# EAGLE design Floppy_V2.5.1_production (EAGLE 7.5.0)
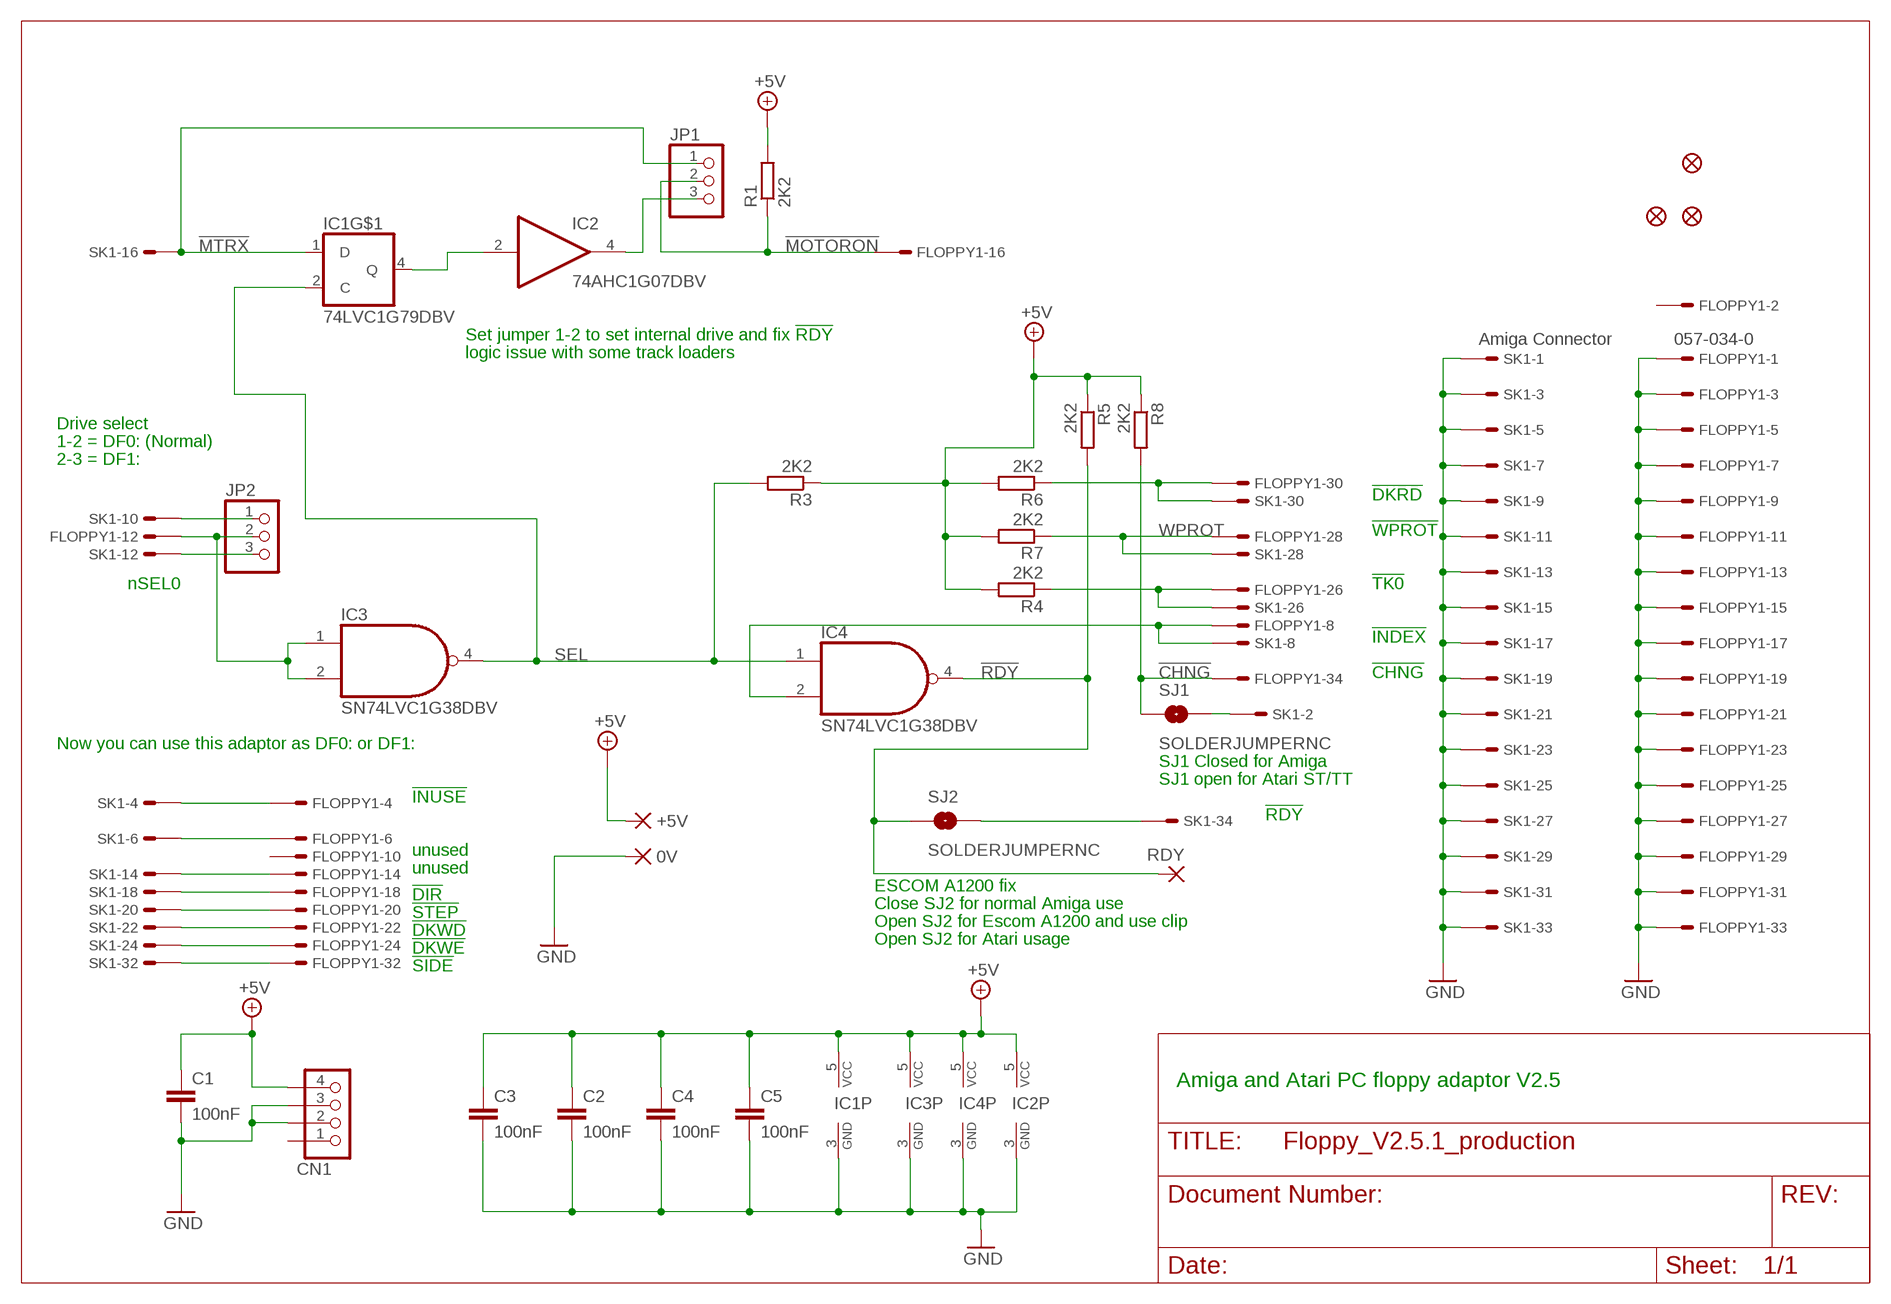
[diagram p0: schematic, sheet 1]

## Parts
0V  PAD-0360-S  [0360-S]
+5V  PAD-0360-S  [0360-S]
C1  100nF  C-EUC0603  [C0603]
C2  100nF  C-EUC0603  [C0603]
C3  100nF  C-EUC0603  [C0603]
C4  100nF  C-EUC0603  [C0603]
C5  100nF  C-EUC0603  [C0603]
CN1  IANS_FLOPPY_RA  [IANS_FLOPPYPOWER__RA]
FLOPPY1  057-034-0  [057-034-0]
IC1  74LVC1G79DBV  [SOT23-5]
IC2  74AHC1G07DBV  [SOT23-5]
IC3  SN74LVC1G38DBV  74AHC1G00DBV  [SOT23-5]
IC4  SN74LVC1G38DBV  74AHC1G00DBV  [SOT23-5]
JP1  PINHD-1X3  [1X03]
JP2  PINHD-1X3  [1X03]
JP3  FIDUCIAL1X2  [FIDUCIAL-1X2]
JP4  FIDUCIAL1X2  [FIDUCIAL-1X2]
JP5  FIDUCIAL1X2  [FIDUCIAL-1X2]
R1  2K2  R-EU_R0603  [R0603]
R3  2K2  R-EU_R0603  [R0603]
R4  2K2  R-EU_R0603  [R0603]
R5  2K2  R-EU_R0603  [R0603]
R6  2K2  R-EU_R0603  [R0603]
R7  2K2  R-EU_R0603  [R0603]
R8  2K2  R-EU_R0603  [R0603]
RDY  2,15/1,0  [2,15/1,0]
SJ1  SOLDERJUMPERNC  [SJ_2S]
SJ2  SOLDERJUMPERNC  [SJ_2S]
SK1  Amiga Connector  057-034-1  [057-034-1]

## Nets
!CHNG: FLOPPY1.34 R8.2 SJ1.1
!MOTORON: FLOPPY1.16 JP1.2 R1.1
!MTRX: IC1.1(D) JP1.1 SK1.16
!RDY: IC4.4(O) R5.2 RDY.1(P) SJ2.1
+5V: +5V.P$1(P) C1.1 C2.1 C3.1 C4.1 C5.1 CN1.4(+5V) IC1.5(VCC) IC2.5(VCC) IC3.5(VCC) IC4.5(VCC) R1.2 R3.1 R4.2 R5.1 R6.2 R7.2 R8.1
GND: 0V.P$1(P) C1.2 C2.2 C3.2 C4.2 C5.2 CN1.2(GND) CN1.3(GND) FLOPPY1.1 FLOPPY1.3 FLOPPY1.5 FLOPPY1.7 FLOPPY1.9 FLOPPY1.11 FLOPPY1.13 FLOPPY1.15 FLOPPY1.17 FLOPPY1.19 FLOPPY1.21 FLOPPY1.23 FLOPPY1.25 FLOPPY1.27 FLOPPY1.29 FLOPPY1.31 FLOPPY1.33 IC1.3(GND) IC2.3(GND) IC3.3(GND) IC4.3(GND) SK1.1 SK1.3 SK1.5 SK1.7 SK1.9 SK1.11 SK1.13 SK1.15 SK1.17 SK1.19 SK1.21 SK1.23 SK1.25 SK1.27 SK1.29 SK1.31 SK1.33
N$1: IC1.4(Q) IC2.2(I)
N$2: IC2.4(O) JP1.3
N$4: FLOPPY1.8 IC4.2(I1) SK1.8
N$5: FLOPPY1.26 R4.1 SK1.26
N$6: FLOPPY1.14 SK1.14
N$8: FLOPPY1.30 R6.1 SK1.30
N$9: JP2.1 SK1.10
N$10: FLOPPY1.12 IC3.1(I0) IC3.2(I1) JP2.2
N$11: JP2.3 SK1.12
N$12: FLOPPY1.18 SK1.18
N$13: FLOPPY1.20 SK1.20
N$14: FLOPPY1.22 SK1.22
N$15: FLOPPY1.24 SK1.24
N$16: FLOPPY1.32 SK1.32
N$17: FLOPPY1.4 SK1.4
N$18: FLOPPY1.6 SK1.6
N$19: SJ1.2 SK1.2
N$20: SJ2.2 SK1.34
SEL: IC1.2(C) IC3.4(O) IC4.1(I0) R3.2
WPROT: FLOPPY1.28 R7.1 SK1.28
Unconnected: CN1.1(+12V) FLOPPY1.2 FLOPPY1.10

## Notes on the sheet
- Set jumper 1-2 to set internal drive and fix !RDY
- logic issue with some track loaders
- Drive select
- 1-2 = DF0: (Normal)
- 2-3 = DF1:
- !DKRD
- !WPROT
- nSEL0 | !TK0
- !INDEX
- !CHNG
- Now you can use this adaptor as DF0: or DF1:
- SJ1 Closed for Amiga
- SJ1 open for Atari ST/TT
- !INUSE
- !RDY
- unused
- unused
- ESCOM A1200 fix
- !DIR
- Close SJ2 for normal Amiga use
- !STEP
- Open SJ2 for Escom A1200 and use clip
- !DKWD
- Open SJ2 for Atari usage
- !DKWE
- !SIDE
- Amiga and Atari PC floppy adaptor V2.5

## Library data of the parts
0V +5V = dpads:PAD: WIRE PAD Standard US Drill Sizes and SMD pads
C1-C5 = resistor:C-EU: CAPACITOR, European symbol
CN1 = Floppy-connectors:IANS_FLOPPY_RA
FLOPPY1 = Floppy-connectors:057-034-: CONNECTOR 34-pin series 057 contact pc boardFloppy drive headers Rapid part numbers Normal right Angle 50-8132; OC_FARNELL: unknown; OC_NEWARK: unknown
IC1 = 74xx-little-us:74*1G79: Single Positive-Edge-Triggered D-Type Flip-Flop Source: Data sheet <http://www.ti.com/lit/ds/symlink/sn74lvc1g79.pdf>
IC2 = 74xx-little-us:74*1G07: Single Buffer/Driver With Open-Drain Output
IC3 IC4 = 74xx-little-us:74*1G00: 2-input NAND gate
JP1 JP2 = pinhead:PINHD-1X3: PIN HEADER
JP3-JP5 = SparkFun:FIDUCIAL: Fiducial Alignment Points Various fiducial points for machine vision alignment.
R1 R3-R8 = resistor:R-EU_: RESISTOR, European symbol
RDY = wirepad:2,15/1,0: THROUGH-HOLE PAD
SJ1 SJ2 = SparkFun:SOLDERJUMPER: Solder Jumper Standard SMD solder jumper. Used to automate production. Two varients : Normally Open and Normally Closed are the same, but have different paste layers. NC will have a large amount of paste and should jumper during reflow.
SK1 = con-panduit:057-034-: CONNECTOR 34-pin series 057 contact pc board low profile headers; OC_FARNELL: unknown; OC_NEWARK: unknown

## Board
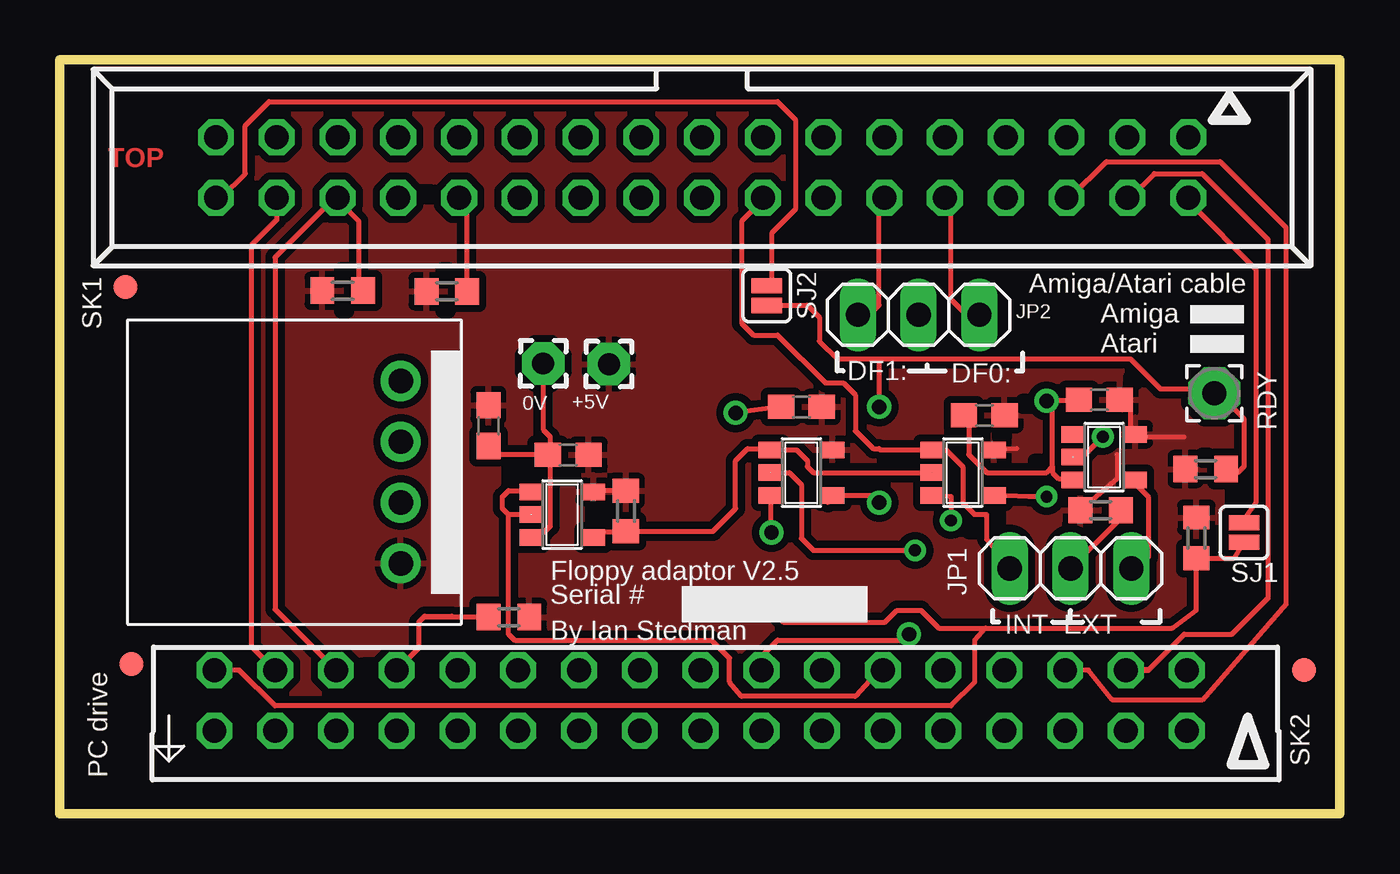
[diagram p1: board, top side]
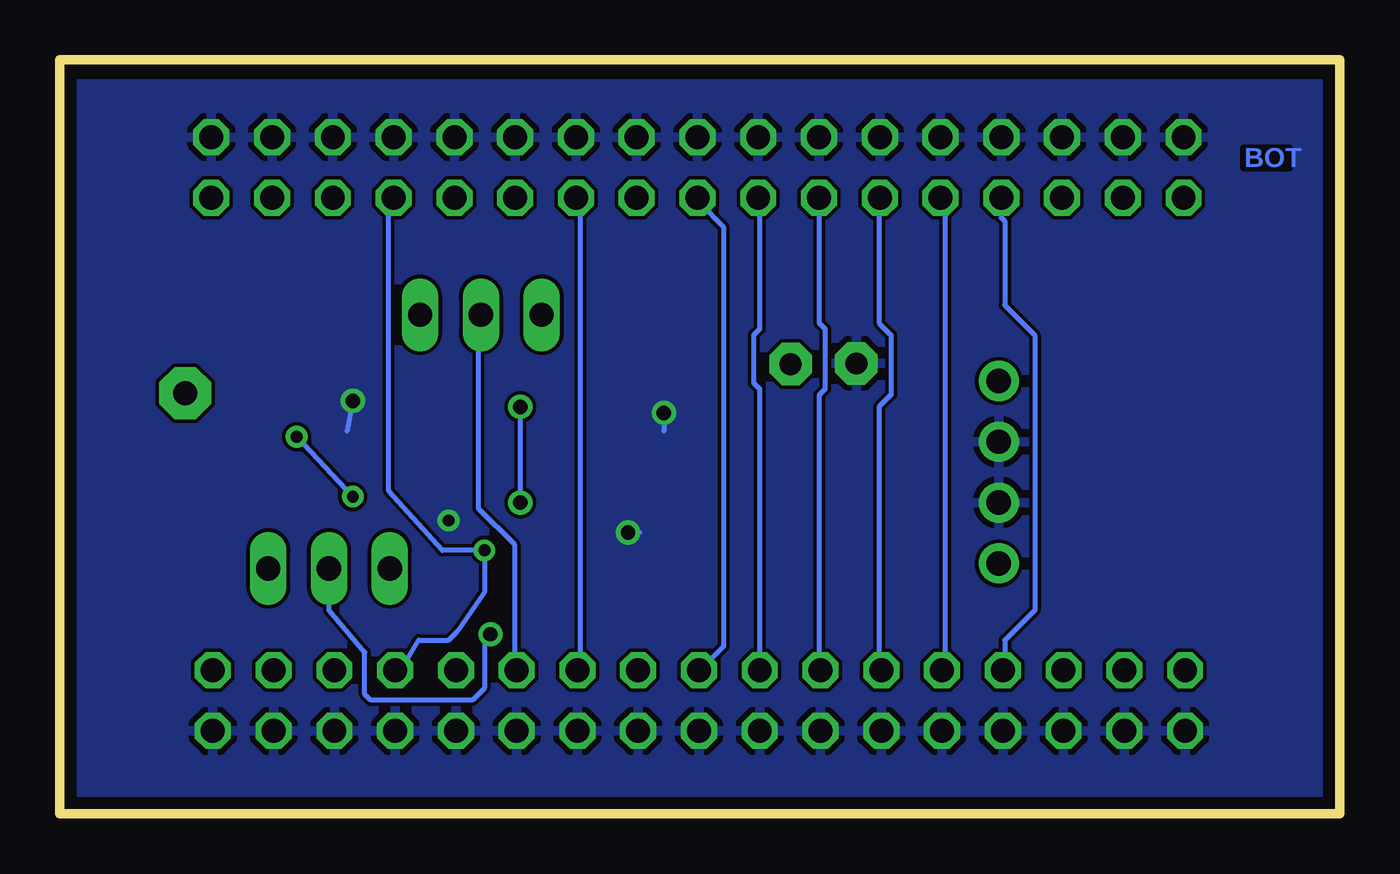
[diagram p2: board, bottom side, seen from below]

Size 53.5 x 31.5 mm. Coordinates in mm from the lower left corner, seen from the top.
Outline: 0,31.5 0,0 53.5,0 53.5,31.5 0,31.5
Copper layers (1*16): Top 0.035mm / dielectric 1.5mm / Bottom 0.035mm
Design rules "Ragworm": minimum track width 0.15mm, minimum drill 0.5mm, track to track 6mil, track to pad 6mil, pad to pad 6mil, via to via 6mil, smd to smd 6mil, copper to edge 0.5mm, drill to drill 0.5mm, minimum pad ring 5mil, minimum via ring 8mil, stop-mask expansion 0mil, vias tented up to drill 0mil, thermal gap 10mil
tRestrict: area 12.8,6 to 13,6.2; area 15.2,25.8 to 15.5,26; area 39.2,15.8 to 39.5,16; area 40.2,17 to 40.5,17.2; area 40.8,14.5 to 41,14.8; area 39,12 to 39.2,12.5; area 38,11.8 to 38.2,12; area 49,13 to 49.2,13.5; area 48.2,11.5 to 48.5,11.8; area 47.8,14.8 to 48,15; area 44.8,18 to 45,18.2; area 18.8,14 to 19,14.5; 8 more areas

### Footprints (pad centres in the part's own frame; a part is rotated, then mirrored left to right if it is on the bottom)
0360-S = drill 0.914 pad 1.778 octagon: P$1 0,0
C0603 = smd 1.1 x 1: 1 -0.85,0; 2 0.85,0
IANS_FLOPPYPOWER__RA = drill 1.016 pad 1.676: 1 0,5.08; 2 0,2.54; 3 0,0; 4 0,-2.54
057-034-0 = drill 1 octagon: 1 -20.32,-2.54; 2 -20.32,-5.08; 3 -17.78,-2.54; 4 -17.78,-5.08; 5 -15.24,-2.54; 6 -15.24,-5.08; 7 -12.7,-2.54; 8 -12.7,-5.08; 9 -10.16,-2.54; 10 -10.16,-5.08; 11 -7.62,-2.54; 12 -7.62,-5.08; 13 -5.08,-2.54; 14 -5.08,-5.08; 15 -2.54,-2.54; 16 -2.54,-5.08; 17 0,-2.54; 18 0,-5.08; 19 2.54,-2.54; 20 2.54,-5.08; 21 5.08,-2.54; 22 5.08,-5.08; 23 7.62,-2.54; 24 7.62,-5.08; 25 10.16,-2.54; 26 10.16,-5.08; 27 12.7,-2.54; 28 12.7,-5.08; 29 15.24,-2.54; 30 15.24,-5.08; 31 17.78,-2.54; 32 17.78,-5.08; 33 20.32,-2.54; 34 20.32,-5.08
SOT23-5 = smd 0.69 x 0.99: 1 -0.95,-1.29; 2 0,-1.29; 3 0.95,-1.29; 4 0.95,1.3; 5 -0.95,1.3
1X03 = drill 1.016 long: 1 -2.54,0; 2 0,0; 3 2.54,0
FIDUCIAL-1X2 = smd 1 x 1: 1 0,0
R0603 = smd 1 x 1.1: 1 -0.85,0; 2 0.85,0
2,15/1,0 = drill 1.016 pad 2.159 octagon: 1 0,0
SJ_2S = smd 0.635 x 1.27: 1 -0.412,0; 2 0.412,0
057-034-1 = drill 1 octagon: 1 -20.32,-1.27; 2 -20.32,1.27; 3 -17.78,-1.27; 4 -17.78,1.27; 5 -15.24,-1.27; 6 -15.24,1.27; 7 -12.7,-1.27; 8 -12.7,1.27; 9 -10.16,-1.27; 10 -10.16,1.27; 11 -7.62,-1.27; 12 -7.62,1.27; 13 -5.08,-1.27; 14 -5.08,1.27; 15 -2.54,-1.27; 16 -2.54,1.27; 17 0,-1.27; 18 0,1.27; 19 2.54,-1.27; 20 2.54,1.27; 21 5.08,-1.27; 22 5.08,1.27; 23 7.62,-1.27; 24 7.62,1.27; 25 10.16,-1.27; 26 10.16,1.27; 27 12.7,-1.27; 28 12.7,1.27; 29 15.24,-1.27; 30 15.24,1.27; 31 17.78,-1.27; 32 17.78,1.27; 33 20.32,-1.27; 34 20.32,1.27

### Placement (x,y rotation side)
0V  20.2,18.81 270 top
+5V  22.95,18.79 270 top
C1  17.92,16.21 270 top
C2  21.25,15 180 top
C3  31,17 180 top
C4  38.64,16.65 180 top
C5  43.45,17.3 180 top
CN1  14.25,13 0 top
FLOPPY1  26.78,0.92 180 top
IC1  37.75,14.25 270 top
IC2  43.65,14.9 270 top
IC3  21,12.5 270 top
IC4  31,14.25 270 top
JP1  42.25,10.25 0 top
JP2  35.9,20.84 180 top
JP3  3,6.25 0 top
JP4  52,6 0 top
JP5  2.75,22 0 top
R1  43.5,12.68 180 top
R3  23.66,12.64 270 top
R4  16.18,21.82 180 top
R5  47.9,14.4 0 top
R6  11.82,21.86 180 top
R7  18.77,8.21 0 top
R8  47.51,11.53 270 top
RDY  48.26,17.57 0 top
SJ1  49.5,11.75 90 top
SJ2  29.55,21.65 90 top
SK1  26.85,27 180 top

### Tracks (layer width: path | path; a pad name or v marks a point on that pad's centre or on a via)
!CHNG
  Top 0.2: FLOPPY1.34 7.5,6 9,4.5 37.25,4.5 38.25,5.5 38.25,7.25 38.7,7.75 | 29.5,8.75 30.25,8 34.5,8 35,8.5 36,8.5 36.75,7.75 38.7,7.75 | 38.7,7.75 46.5,7.75 47.5,8.5 R8.2 49.09,10.68 SJ1.1
!MOTORON  (via drill 0.6)
  Top 0.2: R1.1 44.25,12.5 44.25,12.25 JP1.2 | FLOPPY1.16 29.32,6.57 30,7.25 35.25,7.25 v35.5,7.5
  Bottom 0.2: v35.5,7.5 35.75,7.25 35.75,5.25 36.25,4.75 40.5,4.75 40.75,5 40.75,6.75 42.25,8.5 JP1.2
!MTRX
  Top 0.2: SK1.16 29.25,25.5 28.5,24.75 28.5,20.5 29,20 30,20 32,18 32.75,18 33.25,17.5 33.25,16 34,15.25 34.25,15.25 34.3,15.2 IC1.1 37.05,15.2 37.75,14.5 37.75,13 38.25,12.5 38.75,12.5 38.75,11.46 JP1.1
!RDY  (via drill 0.6)
  Top 0.15: 48.5,17.5 RDY.1 48.25,17.75 | 29.75,21 SJ2.1
  Top 0.2: 48.5,17.5 49.5,16.5 49.5,14.5 49.25,14.25 48.9,14.25 R5.2 | 48.25,17.75 46,17.75 44.75,19 34.25,19 | 32.1,13 IC4.4 33.95,13.3 v34.25,13 | 34.25,19 32.5,19 31.75,19.75 31.75,20.75 31.25,21.25 30,21.25 29.75,21 | 34.25,19 v34.25,17
  Bottom 0.2: v34.25,13 v34.25,17
+5V
  Top 0.15: 39.5,16.5 C4.1 | 15.5,21.75 R4.2
  Top 0.2: 40,15.25 IC1.5 | IC2.5 44.75,16 44.75,17 44.5,17.25 C5.1 | 44.2,15 44.2,14 42.75,12.75 R1.2 42.5,12.5 | 44.75,15.75 IC2.5 | 47,15.75 45,15.75 IC2.5 | 11,21.75 R6.2 | 17.75,17 C1.1 18,16.75 | IC3.5 22.5,13.5 23.5,13.5 R3.1 | 22,15 C2.1
  pour Top (isolate 0.305): 0.75,30.75 53,30.75 53,0.5 0.75,0.5
GND  (via drill 0.5, 0.6)
  Top 0.2: 42.25,14 IC2.3 42.31,14 41.75,14 41.5,14.25 41.5,14.5 | C5.2 42.5,17.25 v41.25,17.25 41.5,17 41.5,14.5 | 38,16.75 C4.2 38,16.5 38,15 38.75,14.25 41.25,14.25 41.5,14.5 | IC3.3 19.75,11.75 20.25,11.75 20.5,12 20.5,15 C2.2 | C2.2 18,15 C1.2 17.75,15 | IC1.3 37.25,13.25 v37.25,12.25 | 27,28.25 SK1.17 | 20.45,15.05 C2.2 | 0V.P$1 20.2,16.05 20.5,15.75 20.5,15.1 C2.2 | 29.83,16.75 C3.2 v28.25,16.75 | IC4.3 29.71,11.79 v29.75,11.75
  Top 0.254: 17.8,15.25 C1.2
  Bottom 0.2: v41.25,17.25 41.5,16 | v28.25,16.75 28.25,16 | v29.75,11.75 29.25,11.75
  pour Bottom: 0.5,30.5 53,30.5 53,0.5 0.5,0.5
N$1  (via drill 0.5)
  Top 0.2: v41.25,13.25 40.5,13.25 IC1.4 | IC2.2 42.5,15 42.85,15 v43.6,15.75
  Bottom 0.2: v43.6,15.75 v41.25,13.25
N$2
  Top 0.2: IC2.4 45,13.75 45.5,13.25 45.5,10.71 JP1.3
N$4  (via drill 0.5)
  Top 0.2: IC4.2 30.5,14.25 31,13.75 31,11.5 31.5,11 v35.75,11
  Bottom 0.15: 36.88,7.62 36.75,7.75 | 39.75,25.5 SK1.8
  Bottom 0.2: FLOPPY1.8 39.25,6 38.5,7.25 37.25,7.25 36.88,7.62 35.75,9.25 v35.75,11 37.5,11 39.75,13.5 39.75,25.5
N$5
  Top 0.15: 17,22 R4.1
  Top 0.2: 17,22 17,25.25 16.75,25.5 SK1.26
  Bottom 0.2: 16.5,6 FLOPPY1.26 16.5,6.12 16.5,25.5 SK1.26
N$6
  Bottom 0.2: FLOPPY1.14 31.75,6 31.75,25.5 SK1.14
N$8
  Top 0.2: R6.1 12.5,22 12.5,24.75 11.75,25.5 SK1.30 11.48,25.73 9,23.25 9,8.54 FLOPPY1.30
N$9
  Top 0.15: 37.25,25.5 SK1.10
  Top 0.2: 37.25,25.5 37.25,21.5 37.75,21 38.28,21 JP2.1
N$10
  Top 0.15: 19.75,12.5 IC3.2 19.5,12.5
  Top 0.2: 19.75,13.25 IC3.1 19.66,13.5 18.75,13.5 18.5,13.25 18.5,12.75 18.75,12.5 | FLOPPY1.12 34.25,6 33.25,4.9 28.5,4.9 28,5.5 28,6.5 27.25,7.25 19,7.25 18.75,7.5 18.75,12.5 | 19.75,12.5 18.75,12.5
  Bottom 0.2: 34.5,6 FLOPPY1.12 34.5,6.1 34.5,11.25 36,12.75 36,20.5 35.9,20.6 JP2.2
N$11
  Top 0.2: SK1.12 34.25,25.5 34.25,21.25 33.84,20.84 JP2.3
N$12
  Bottom 0.2: FLOPPY1.18 26.75,6 25.75,7 25.75,24.5 26.75,25.5 SK1.18
N$13
  Bottom 0.2: FLOPPY1.20 24.25,17.75 24.5,18 24.5,20 24.25,20.25 24.25,25.5 SK1.20
N$14
  Bottom 0.2: FLOPPY1.22 21.75,6 21.75,17.5 21.5,17.75 21.5,20.25 21.75,20.5 21.75,25.71 SK1.22 21.75,25.5
N$15
  Bottom 0.2: 19.25,6 FLOPPY1.24 19.25,6.09 19.25,17 18.75,17.5 18.75,20 19.25,20.5 19.25,25.5 SK1.24
N$16
  Top 0.2: SK1.32 9.07,24.82 8,23.75 8,7 FLOPPY1.32
N$17
  Top 0.2: 45.5,6 47,7.5 49,7.5 50.5,9 50.5,24 47.75,26.75 45.75,26.75 44.75,25.75 SK1.4
  Top 0.254: 45.5,6 FLOPPY1.4
N$18
  Top 0.2: FLOPPY1.6 43,6 44,4.75 47.75,4.75 51.25,8.75 51.25,24.5 48.5,27.25 43.75,27.25 42.25,25.75 SK1.6
N$19
  Top 0.2: SK1.2 47.25,25.5 50,22.75 50,13 49.41,12.16 SJ1.2
N$20
  Top 0.15: 29.75,22.25 SJ2.2
  Top 0.2: 29.75,22.25 29.75,24.25 30.75,25.25 30.75,29 30,29.75 8.75,29.75 7.75,28.75 7.75,26.75 6.75,25.75 SK1.34
SEL
  Top 0.15: 23.5,11.75 R3.2
  Top 0.2: 23.5,11.75 22.5,11.75 IC3.4 | 36.5,14.25 IC1.2 31.5,14.25 31.25,14.5 31.25,14.75 30.8,15.2 IC4.1 29.66,15.25 28.75,15.25 28.25,14.75 28.25,12.75 27.3,11.79 R3.2
WPROT
  Top 0.2: FLOPPY1.28 15,6.92 15,8 15.25,8.25 | 15.25,8.25 16.39,8.25 R7.1 15.29,8.21 15.25,8.25
  Bottom 0.2: SK1.28 14.15,24.9 14,24.75 14,21.25 12.75,20 12.75,8.5 14,7.25 14,6.08 FLOPPY1.28

### Text on the board
Top: TOP
Bottom: BOT
tPlace: Amiga/Atari cable | SK1 | Amiga | Atari | DF1: | DF0: | Floppy adaptor V2.5 | Serial # | INT EXT | By Ian Stedman | PC drive | SK2